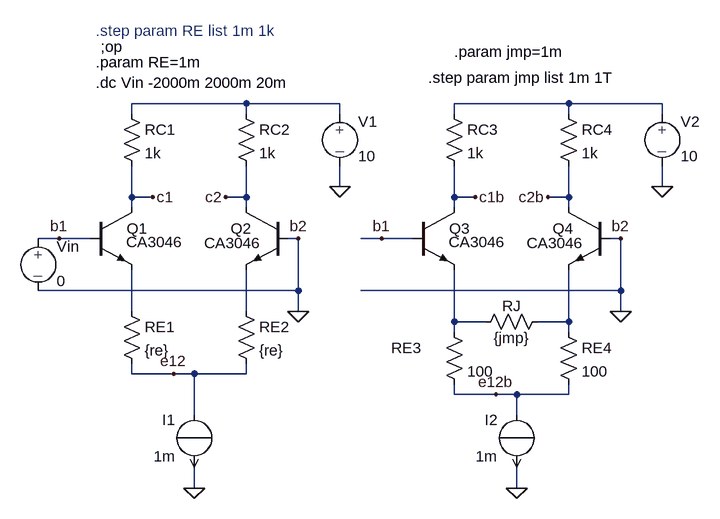
[diagram p0: schematic diff1.asc]
diff1.asc, the LTspice schematic file:
Version 4
SHEET 1 1252 680
WIRE 368 -48 192 -48
WIRE 512 -48 368 -48
WIRE 864 -48 688 -48
WIRE 1008 -48 864 -48
WIRE 192 -32 192 -48
WIRE 368 -32 368 -48
WIRE 512 -32 512 -48
WIRE 688 -32 688 -48
WIRE 864 -32 864 -48
WIRE 1008 -32 1008 -48
WIRE 512 80 512 48
WIRE 1008 80 1008 48
WIRE 192 96 192 48
WIRE 224 96 192 96
WIRE 368 96 368 48
WIRE 368 96 336 96
WIRE 688 96 688 48
WIRE 720 96 688 96
WIRE 864 96 864 48
WIRE 864 96 832 96
WIRE 192 112 192 96
WIRE 368 112 368 96
WIRE 688 112 688 96
WIRE 864 112 864 96
WIRE 80 160 48 160
WIRE 128 160 80 160
WIRE 448 160 432 160
WIRE 576 160 544 160
WIRE 624 160 576 160
WIRE 944 160 928 160
WIRE 448 240 448 160
WIRE 448 240 48 240
WIRE 944 240 944 160
WIRE 944 240 544 240
WIRE 192 272 192 208
WIRE 368 272 368 208
WIRE 448 272 448 240
WIRE 944 272 944 240
WIRE 688 288 688 208
WIRE 736 288 688 288
WIRE 864 288 864 208
WIRE 864 288 816 288
WIRE 688 304 688 288
WIRE 864 304 864 288
WIRE 192 368 192 352
WIRE 256 368 192 368
WIRE 288 368 256 368
WIRE 368 368 368 352
WIRE 368 368 288 368
WIRE 688 400 688 384
WIRE 752 400 688 400
WIRE 784 400 752 400
WIRE 864 400 864 384
WIRE 864 400 784 400
WIRE 288 432 288 368
WIRE 784 432 784 400
WIRE 288 544 288 512
WIRE 784 544 784 512
FLAG 288 544 0
FLAG 512 80 0
FLAG 224 96 c1
FLAG 336 96 c2
FLAG 80 160 b1
FLAG 448 160 b2
FLAG 256 368 e12
FLAG 448 272 0
FLAG 784 544 0
FLAG 1008 80 0
FLAG 720 96 c1b
FLAG 832 96 c2b
FLAG 576 160 b1
FLAG 944 160 b2
FLAG 752 400 e12b
FLAG 944 272 0
SYMBOL EIT_Semiconductors\\npn 128 112 R0
WINDOW 3 55 53 Left 2
SYMATTR Value CA3046
SYMATTR InstName Q1
SYMBOL EIT_Semiconductors\\npn 432 112 M0
WINDOW 3 42 55 Left 2
SYMATTR Value CA3046
SYMATTR InstName Q2
SYMBOL source-I 288 512 R180
WINDOW 0 29 73 Left 2
WINDOW 3 29 17 Left 2
SYMATTR InstName I1
SYMATTR Value 1m
SYMBOL source-V 48 144 R0
SYMATTR InstName Vin
SYMATTR Value 0
SYMBOL res 176 -48 R0
SYMATTR InstName RC1
SYMATTR Value 1k
SYMBOL res 352 -48 R0
SYMATTR InstName RC2
SYMATTR Value 1k
SYMBOL source-V 512 -48 R0
SYMATTR InstName V1
SYMATTR Value 10
SYMBOL res 176 256 R0
SYMATTR InstName RE1
SYMATTR Value {re}
SYMBOL res 352 256 R0
SYMATTR InstName RE2
SYMATTR Value {re}
SYMBOL EIT_Semiconductors\\npn 624 112 R0
WINDOW 3 55 53 Left 2
SYMATTR Value CA3046
SYMATTR InstName Q3
SYMBOL EIT_Semiconductors\\npn 928 112 M0
WINDOW 3 42 55 Left 2
SYMATTR Value CA3046
SYMATTR InstName Q4
SYMBOL source-I 784 512 R180
WINDOW 0 29 73 Left 2
WINDOW 3 29 17 Left 2
SYMATTR InstName I2
SYMATTR Value 1m
SYMBOL res 672 -48 R0
SYMATTR InstName RC3
SYMATTR Value 1k
SYMBOL res 848 -48 R0
SYMATTR InstName RC4
SYMATTR Value 1k
SYMBOL source-V 1008 -48 R0
SYMATTR InstName V2
SYMATTR Value 10
SYMBOL res 672 288 R0
WINDOW 0 -81 40 Left 2
SYMATTR InstName RE3
SYMATTR Value 100
SYMBOL res 848 288 R0
SYMATTR InstName RE4
SYMATTR Value 100
SYMBOL res 720 304 R270
WINDOW 0 25 56 VTop 2
WINDOW 3 7 56 VBottom 2
SYMATTR InstName RJ
SYMATTR Value {jmp}
TEXT 144 -136 Left 2 !;op
TEXT 136 -80 Left 2 !.dc Vin -2000m 2000m 20m
TEXT 136 -112 Left 2 !.param RE=1m
TEXT 136 -160 Left 2 ;.step param RE list 1m 1k
TEXT 688 -128 Left 2 !.param jmp=1m
TEXT 648 -88 Left 2 !.step param jmp list 1m 1T

The netlist it stands for:
* diff1.asc
Q1 c1 b1 N003 0 CA3046
Q2 c2 0 N004 0 CA3046
I1 e12 0 1m
Vin b1 0 0
RC1 N001 c1 1k
RC2 N001 c2 1k
V1 N001 0 10
RE1 N003 e12 {re}
RE2 N004 e12 {re}
Q3 c1b b1 N005 0 CA3046
Q4 c2b 0 N006 0 CA3046
I2 e12b 0 1m
RC3 N002 c1b 1k
RC4 N002 c2b 1k
V2 N002 0 10
RE3 N005 e12b 100
RE4 N006 e12b 100
RJ N005 N006 {jmp}
.model NPN NPN
.model PNP PNP
.lib standard.bjt
;op
.dc Vin -2000m 2000m 20m
.param RE=1m
* .step param RE list 1m 1k
.param jmp=1m
.step param jmp list 1m 1T
.backanno
.end